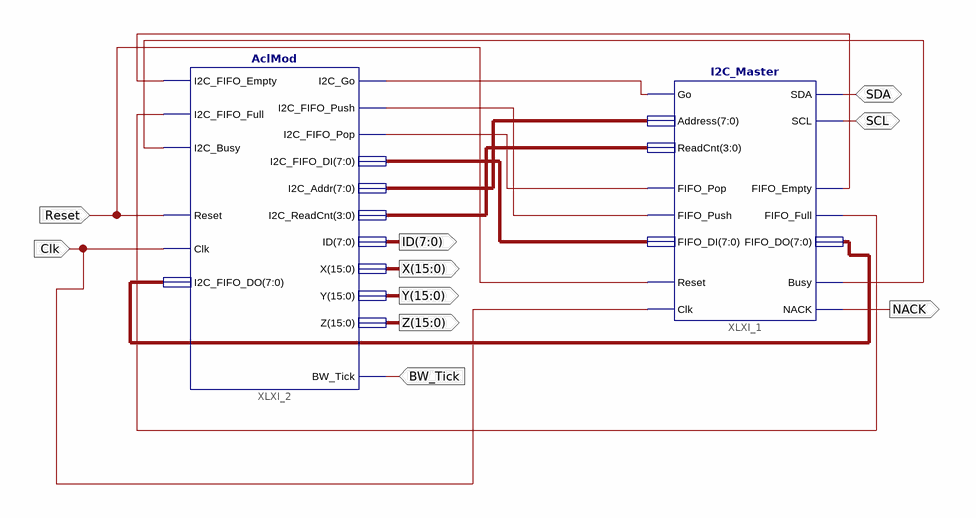
[diagram p0: schematic sheet 1]
// Xilinx ISE schematic AccelADXL345.sch (xc9500xl) as structural Verilog: 2 symbols, 10 ports
module AccelADXL345 (
  input  Clk,
  input  Reset,
  input  BW_Tick,
  inout  SCL,
  inout  SDA,
  output [15:0] X,
  output [7:0] ID,
  output [15:0] Y,
  output [15:0] Z,
  output NACK
);

  wire XLXN_1, XLXN_2, XLXN_3, XLXN_7, XLXN_8, XLXN_49;
  wire [3:0] XLXN_6;
  wire [7:0] XLXN_4, XLXN_5, XLXN_10;

  I2C_Master XLXI_1 (
    .Go(XLXN_1), .Address(XLXN_5), .ReadCnt(XLXN_6), .SDA(SDA), .SCL(SCL), .FIFO_Pop(XLXN_3),
    .FIFO_Push(XLXN_2), .FIFO_DI(XLXN_4), .FIFO_Empty(XLXN_7), .FIFO_Full(XLXN_8), .FIFO_DO(XLXN_10),
    .Reset(Reset), .Clk(Clk), .Busy(XLXN_49), .NACK(NACK));
  AclMod XLXI_2 (
    .I2C_FIFO_Empty(XLXN_7), .I2C_FIFO_Full(XLXN_8), .I2C_Busy(XLXN_49), .Reset(Reset), .Clk(Clk),
    .BW_Tick(BW_Tick), .I2C_FIFO_DO(XLXN_10), .I2C_Go(XLXN_1), .I2C_FIFO_Push(XLXN_2), .I2C_FIFO_Pop(XLXN_3),
    .I2C_FIFO_DI(XLXN_4), .I2C_Addr(XLXN_5), .I2C_ReadCnt(XLXN_6), .ID(ID), .X(X), .Y(Y), .Z(Z));
endmodule
